# Altium project Inverter_control_r2.PrjPcb
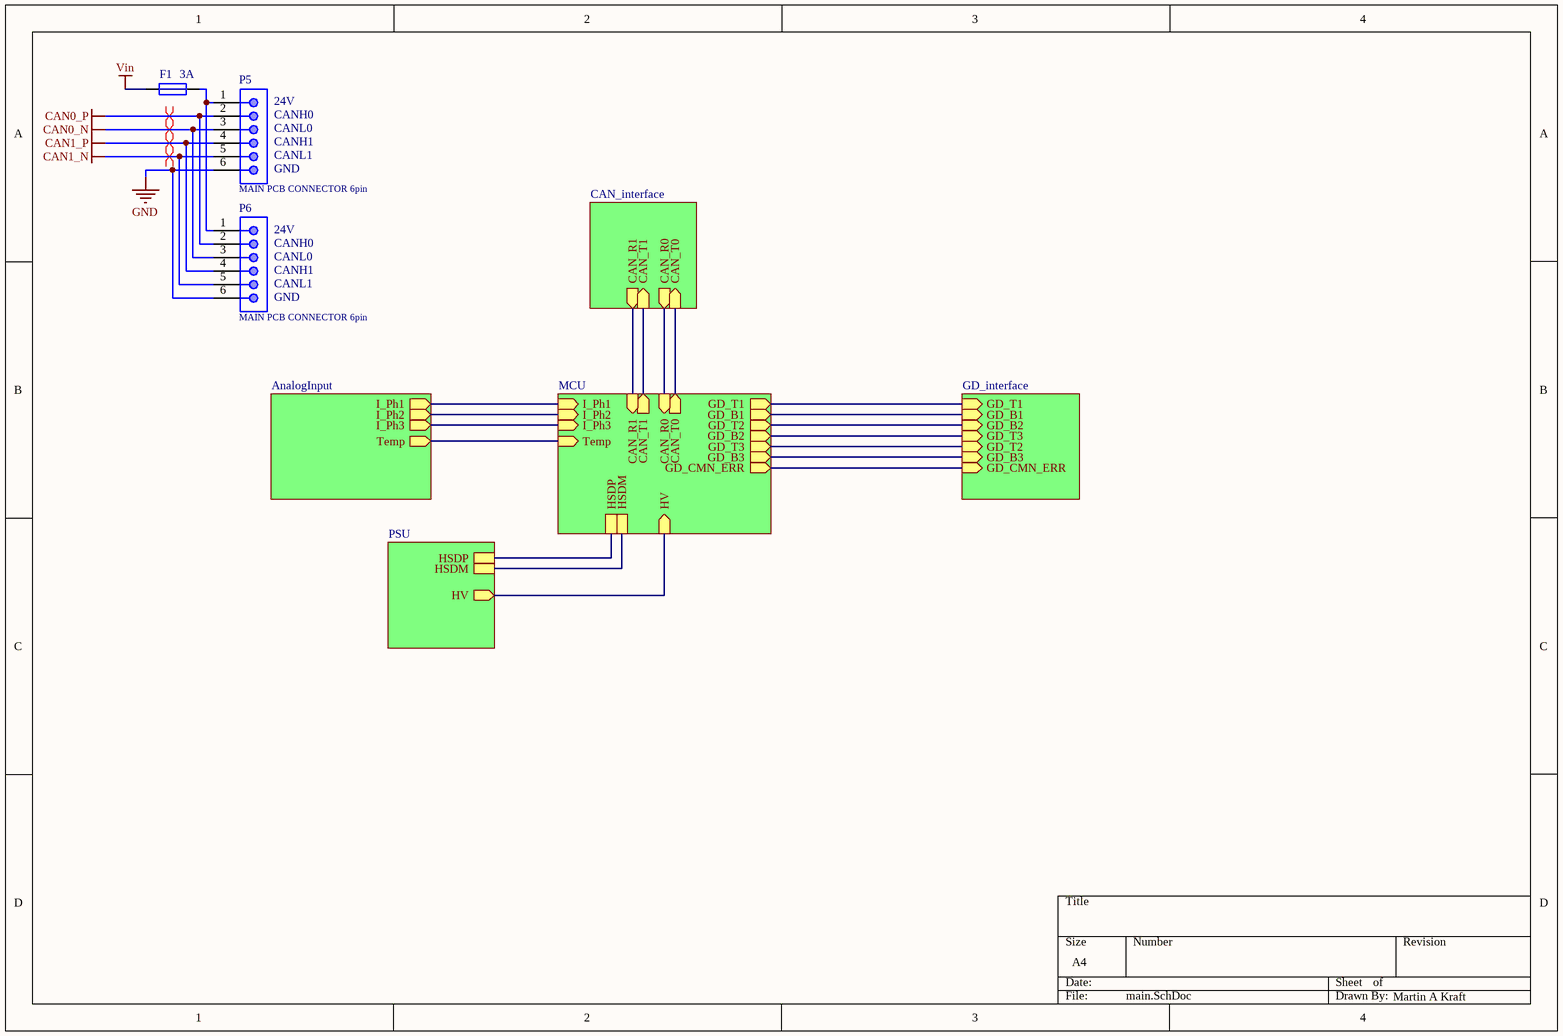
[diagram p0: main.SchDoc]
10 sheets, 146 parts. Net scope: hierarchical (ports join the sheet entries above them; power ports are global).
Board file: Inverter_control_r2.PcbDoc
Sheets:
  main.SchDoc
    MCU = MCU.SchDoc
    GD_interface = GD_interface.SchDoc
    CAN_interface = CAN_interface.SchDoc
      CAN0 = CAN0.SchDoc
      CAN1 = CAN1.SchDoc
    PSU = PSU.SchDoc
      3V3 = 3V3.SchDoc
      5V = 5V.SchDoc
      GD_supply = GD_supply.SchDoc

## Sheet main.SchDoc
size A4

### Parts
F1  3A  [F_OMH125]
P5  MAIN PCB CONNECTOR 6pin  [662106145021]
P6  MAIN PCB CONNECTOR 6pin  [662106145021]

### Sub-sheets
AnalogInput = InverterControl_AnalogIn.SchDoc (file not in this document): I_Ph1 (out), I_Ph2 (out), I_Ph3 (out), Temp (out)
CAN_interface = CAN_interface.SchDoc: CAN_R0 (out), CAN_T0 (in), CAN_R1 (out), CAN_T1 (in)
GD_interface = GD_interface.SchDoc: GD_T1 (in), GD_B1 (in), GD_T2 (in), GD_B2 (in), GD_T3 (in), GD_B3 (in), GD_CMN_ERR (in)
MCU = MCU.SchDoc: I_Ph1 (in), I_Ph2 (in), I_Ph3 (in), Temp (in), GD_T1 (out), GD_B1 (out), GD_T2 (out), GD_B2 (out), GD_T3 (out), GD_B3 (out), CAN_T0 (out), CAN_R0 (in), CAN_T1 (out), CAN_R1 (in), HSDM, HSDP, HV (in), GD_CMN_ERR (out)
PSU = PSU.SchDoc: HSDM, HSDP, HV (out)

### Nets
CAN0_N: P5.3 P6.3
CAN0_P: P5.2 P6.2
CAN1_N: P5.5 P6.5
CAN1_P: P5.4 P6.4
GND: P5.6 P6.6
Vin: F1.1
CAN_R0: sheet MCU/CAN_R0, sheet CAN_interface/CAN_R0
CAN_R1: sheet MCU/CAN_R1, sheet CAN_interface/CAN_R1
CAN_T0: sheet MCU/CAN_T0, sheet CAN_interface/CAN_T0
CAN_T1: sheet MCU/CAN_T1, sheet CAN_interface/CAN_T1
NetC36_2: sheet MCU/HV, sheet PSU/HV
NetF1_2: F1.2 P5.1 P6.1
NetIC2_3: sheet MCU/GD_B3, sheet GD_interface/GD_B3
NetIC2_5: sheet MCU/GD_B2, sheet GD_interface/GD_T3
NetIC2_7: sheet MCU/GD_T2, sheet GD_interface/GD_B2
NetIC2_9: sheet MCU/GD_T3, sheet GD_interface/GD_T2
NetIC2_11: sheet MCU/GD_B1, sheet GD_interface/GD_B1
NetIC2_14: sheet MCU/GD_T1, sheet GD_interface/GD_T1
NetIC3_13: sheet AnalogInput/I_Ph1, sheet MCU/I_Ph1
NetIC3_14: sheet AnalogInput/I_Ph2, sheet MCU/I_Ph2
NetIC3_15: sheet AnalogInput/I_Ph3, sheet MCU/I_Ph3
NetIC3_16: sheet AnalogInput/Temp, sheet MCU/Temp
NetIC3_52: sheet MCU/GD_CMN_ERR, sheet GD_interface/GD_CMN_ERR
NetIC3_94: sheet MCU/HSDM, sheet PSU/HSDM
NetIC3_95: sheet MCU/HSDP, sheet PSU/HSDP

### Layout directives
differential pair: CAN0_N, CAN0_P, CAN1_N, CAN1_P

### Notes on the sheet
- Martin A Kraft
- (in symbol MAIN PCB CONNECTOR 6pin) 24V; CANH0; CANL0; CANH1; CANL1; GND

### Library data of the parts
F1 = F_Fuse: Fuse - universal; ComponentLink1Description: Datasheet; ComponentLink1URL: https://ch.schurter.com/en/datasheet/typ_OMF_63.pdf
P5 P6 = MAIN PCB CONNECTOR 6pin: SMT Male Header WR-MPC3, with SMT Solder Tabs, Right Angled, Single Row, pitch 3 mm, 6 pins; Pitch: 3 mm; Working Voltage: 250 VAC; Contact Resistance: 10 mOhm; Pin Number: 6; ComponentLink1Description: Manufacturer; ComponentLink1URL: http://www.we-online.de; ComponentLink2Description: Datasheet; ComponentLink2URL: https://katalog.we-online.de/em/datasheet/6621xx145021.pdf; Part Number: 662106145021; Published Date: September 2018; Publisher: Wurth Elektronik; Operating Temperature: -40 to 105 degC; Packaging: Tape and Reel; Gender: Male; Mounting Technology: SMT; Orientation: Right Angled

## Sheet MCU.SchDoc
size A4
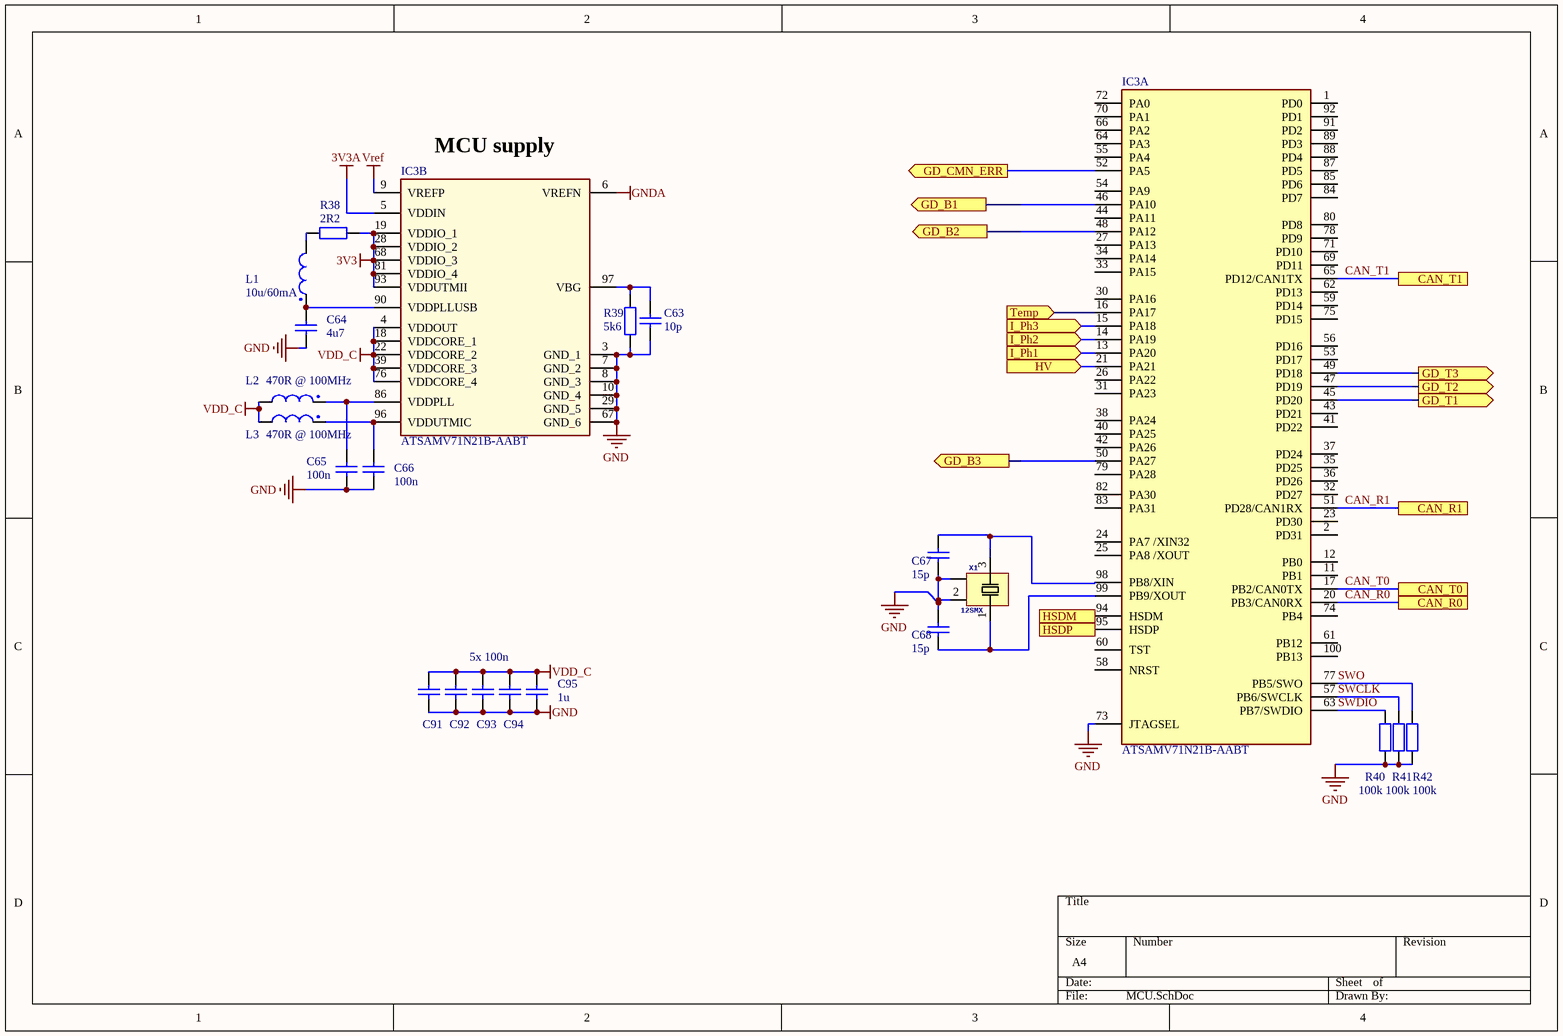
[diagram p1: MCU.SchDoc]

### Parts
C63  10p  [C_0603]
C64  4u7  [C_0805]
C65  100n  [C_0603]
C66  100n  [C_0603]
C67  15p  [C_0603]
C68  15p  [C_0603]
C91  100n  [C_0603]  (value not drawn)
C92  100n  [C_0603]  (value not drawn)
C93  100n  [C_0603]  (value not drawn)
C94  100n  [C_0603]  (value not drawn)
C95  1u  [C_0805]
IC3  ATSAMV71N21B-AABT  [QFP50P1600X1600X160-100N]  (parts A,B of 2)
L1  10u/60mA  [R_0805]
L2  470R @ 100MHz  [R_0805]
L3  470R @ 100MHz  [R_0805]
R38  2R2  [R_0603]
R39  5k6  [R_0603]
R40  100k  [R_0603]
R41  100k  [R_0603]
R42  100k  [R_0603]
X1  12SMX  [WE-XTAL_12SMX]

### Ports
CAN_R0, CAN_R1, CAN_T0, CAN_T1, GD_B1 (out), GD_B2 (out), GD_B3 (out), GD_CMN_ERR (out), GD_T1 (out), GD_T2 (out), GD_T3 (out), HSDM, HSDP, HV (in), I_Ph1 (in), I_Ph2 (in), I_Ph3 (in), Temp (in)

### Nets
3V3: IC3.5(VDDIN) IC3.19(VDDIO_1) IC3.28(VDDIO_2) IC3.68(VDDIO_3) IC3.81(VDDIO_4) IC3.93(VDDUTMII) R38.2  [also labelled 3V3A]
GND: C63.2 C64.1 C65.1 C66.1 C67.2 C68.1 C91.1 C92.1 C93.1 C94.1 C95.1 IC3.3(GND_1) IC3.6(VREFN) IC3.7(GND_2) IC3.8(GND_3) IC3.10(GND_4) IC3.29(GND_5) IC3.67(GND_6) IC3.73(JTAGSEL) R39.2 R40.2 R41.2 R42.2 X1.2 X1.4  [also labelled GNDA]
VDD_C: C91.2 C92.2 C93.2 C94.2 C95.2 IC3.4(VDDOUT) IC3.18(VDDCORE_1) IC3.22(VDDCORE_2) IC3.39(VDDCORE_3) IC3.76(VDDCORE_4) L2.2 L3.2
Vref: IC3.9(VREFP)
CAN_R0: IC3.20(PB3/CAN0RX) ; port CAN_R0
CAN_R1: IC3.51(PD28/CAN1RX) ; port CAN_R1
CAN_T0: IC3.17(PB2/CAN0TX) ; port CAN_T0
CAN_T1: IC3.65(PD12/CAN1TX) ; port CAN_T1
SWCLK: IC3.57(PB6/SWCLK) R41.1
SWDIO: IC3.63(PB7/SWDIO) R40.1
SWO: IC3.77(PB5/SWO) R42.1
NetC36_2: IC3.21(PA21) ; port HV
NetC63_1: C63.1 IC3.97(VBG) R39.1
NetC64_2: C64.2 IC3.90(VDDPLLUSB) L1.1
NetC65_2: C65.2 IC3.86(VDDPLL) L2.1
NetC66_2: C66.2 IC3.96(VDDUTMIC) L3.1
NetC67_1: C67.1 IC3.98(PB8/XIN) X1.3
NetC68_2: C68.2 IC3.99(PB9/XOUT) X1.1
NetIC2_3: IC3.50(PA27) ; port GD_B3
NetIC2_5: IC3.48(PA12) ; port GD_B2
NetIC2_7: IC3.47(PD19) ; port GD_T2
NetIC2_9: IC3.49(PD18) ; port GD_T3
NetIC2_11: IC3.46(PA10) ; port GD_B1
NetIC2_14: IC3.45(PD20) ; port GD_T1
NetIC3_13: IC3.13(PA20) ; port I_Ph1
NetIC3_14: IC3.14(PA19) ; port I_Ph2
NetIC3_15: IC3.15(PA18) ; port I_Ph3
NetIC3_16: IC3.16(PA17) ; port Temp
NetIC3_52: IC3.52(PA5) ; port GD_CMN_ERR
NetIC3_94: IC3.94(HSDM) ; port HSDM
NetIC3_95: IC3.95(HSDP) ; port HSDP
NetL1_2: L1.2 R38.1

Not connected (* = marked no-connect by the designer): IC3 1(PD0) 2(PD31) 11(PB1) 12(PB0) 23(PD30) 24(PA7_/XIN32) 25(PA8_/XOUT) 26(PA22) 27(PA13) 30(PA16) 31(PA23) 32(PD27) 33(PA15) 34(PA14) 35(PD25) 36(PD26) 37(PD24) 38(PA24) 40(PA25) 41(PD22) 42(PA26) 43(PD21) 44(PA11) 53(PD17) 54(PA9) 55(PA4) 56(PD16) 58(NRST) 59(PD14) 60(TST) 61(PB12) 62(PD13) 64(PA3) 66(PA2) 69(PD11) 70(PA1) 71(PD10) 72(PA0) 74(PB4) 75(PD15) 78(PD9) 79(PA28) 80(PD8) 82(PA30) 83(PA31) 84(PD7) 85(PD6) 87(PD5) 88(PD4) 89(PD3) 91(PD2) 92(PD1) 100(PB13)

### Notes on the sheet
- (near IC3) MCU supply
- 5x 100n

### Library data of the parts
C63-C68 C91-C95 = C_MLCC: cond
  C63: Value: 10p
  C64: Value: 4u7
  C65 C66 C91-C94: Value: 100n
  C67 C68: Value: 15p
  C95: Value: 1u
IC3 = ATSAMV71N21B-AABT: Integrated Circuit; Manufacturer_Name: Microchip; Datasheet Link: http://ww1.microchip.com/downloads/en/DeviceDoc/SAM-E70S70V70V71-Family%20DataSheet-DS60001527B.pdf; Height: 1.6mm; Manufacturer_Part_Number: ATSAMV71N21B-AABT; Mouser Part Number: 556-ATSAMV71N21BAABT; Mouser Price/Stock: https://www.mouser.com/Search/Refine.aspx?Keyword=556-ATSAMV71N21BAABT
L1-L3 = L_Inductor_Choke
R38-R42 = R_Uni: Resistor
  R38: Value: 2R2
  R39: Value: 5k6
  R40-R42: Value: 100k
X1 = WE-XTAL_12SMX: WE-XTAL Quartz Crystal   Characteristics   Industry standard packages       Details see: https://katalog.we-online.com/en/pbs/WE-XTAL  Updated by Ella Wu , 2019-09-03  2019 (C) Wurth Elektronik; PART-NUMBER: 830026380; PART-NUMBER: 830026382; PART-NUMBER: 830026384; PART-NUMBER: 830026386; PART-NUMBER: 830026388; PART-NUMBER: 830026392; PART-NUMBER: 830026394; PART-NUMBER: 830026396; PART-NUMBER: 830026504; PART-NUMBER: 830059082; GateName_1: G$1; SymbolName_1: CRYSTAL-4PIN; C-LOAD: 16pF; STABILITY: 50ppm; TOLERANCE: ±30ppm; C-LOAD: 10pF; TOLERANCE: ±20ppm; LibraryName: Eagle_WE-XTAL (rev19a); DeviceSetName: WE-XTAL_12SMX; Package: WE-XTAL_12SMX; DATASHEET-URL: https://katalog.we-online.com/pbs/datasheet/830026380.pdf; MOUNT: SMT; DATASHEET-URL: https://katalog.we-online.com/pbs/datasheet/830026382.pdf; DATASHEET-URL: https://katalog.we-online.com/pbs/datasheet/830026384.pdf; DATASHEET-URL: https://katalog.we-online.com/pbs/datasheet/830026386.pdf; DATASHEET-URL: https://katalog.we-online.com/pbs/datasheet/830026388.pdf; DATASHEET-URL: https://katalog.we-online.com/pbs/datasheet/830026392.pdf; DATASHEET-URL: https://katalog.we-online.com/pbs/datasheet/830026394.pdf; DATASHEET-URL: https://katalog.we-online.com/pbs/datasheet/830026396.pdf; DATASHEET-URL: https://katalog.we-online.com/pbs/datasheet/830026504.pdf; DATASHEET-URL: https://katalog.we-online.com/pbs/datasheet/830059082.pdf

## Sheet GD_interface.SchDoc
size A4
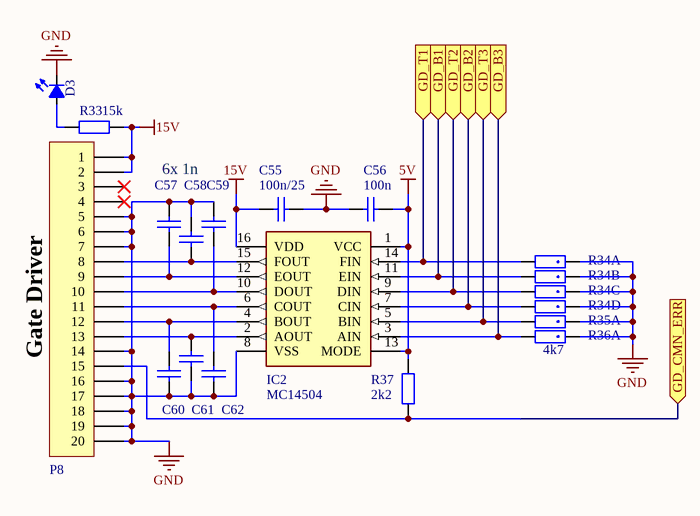
[diagram p2: GD_interface.SchDoc]

### Parts
C55  100n/25  [C_0603]
C56  100n  [C_0603]
C57  1n  [C_0603]  (value not drawn)
C58  1n  [C_0603]  (value not drawn)
C59  1n  [C_0603]  (value not drawn)
C60  1n  [C_0603]  (value not drawn)
C61  1n  [C_0603]  (value not drawn)
C62  1n  [C_0603]  (value not drawn)
D3  Green  [D0603]  (value not drawn)
IC2  MC14504  [SOP65P640X120-16N]
P8  GD  [TE_MicroMatch_20_SMD_Female]  (value not drawn)
R33  15k  [R_0603]
R34  1k  [R_Array  4D03]  (value not drawn)  (parts A,B,C,D of 4)
R35  1k  [R_Array  4D03]  (value not drawn)  (part A of 4)
R36  4k7  [R_Array  4D03]  (part A of 4)
R37  2k2  [R_0603]

### Ports
GD_B1 (in), GD_B2 (in), GD_B3 (in), GD_CMN_ERR (in), GD_T1 (in), GD_T2 (in), GD_T3 (in)

### Nets
5V: C56.2 IC2.1(VCC) IC2.13(MODE) R37.1
15V: C55.1 IC2.16(VDD) P8.1 P8.2 R33.2
GND: C55.2 C56.1 C57.2 C58.2 C59.2 C60.1 C61.1 C62.1 D3.1(K) IC2.8(VSS) P8.5 P8.6 P8.7 P8.14 P8.16 P8.17 P8.18 P8.19 P8.20 R34.1 R34.2 R34.3 R34.4 R35.1 R36.1
NetC57_1: C57.1 IC2.12(EOUT) P8.9
NetC58_1: C58.1 IC2.15(FOUT) P8.8
NetC59_1: C59.1 IC2.10(DOUT) P8.10
NetC60_2: C60.2 IC2.4(BOUT) P8.12
NetC61_2: C61.2 IC2.6(COUT) P8.11
NetC62_2: C62.2 IC2.2(AOUT) P8.13
NetD3_2: D3.2(A) R33.1
NetIC2_3: IC2.3(AIN) R36.8 ; port GD_B3
NetIC2_5: IC2.5(BIN) R35.8 ; port GD_T3
NetIC2_7: IC2.7(CIN) R34.5 ; port GD_B2
NetIC2_9: IC2.9(DIN) R34.6 ; port GD_T2
NetIC2_11: IC2.11(EIN) R34.7 ; port GD_B1
NetIC2_14: IC2.14(FIN) R34.8 ; port GD_T1
NetIC3_52: P8.15 R37.2 ; port GD_CMN_ERR

Not connected (* = marked no-connect by the designer): P8 3* 4*

### Notes on the sheet
- 6x 1n
- (near P8) Gate Driver

### Library data of the parts
C55-C62 = C_MLCC: cond
  C55: Value: 100n/25
  C56: Value: 100n
  C57-C62: Value: 1n
D3 = D_LED small: LED diode
IC2 = IC_MC14504: Level shifter; Manufacturer_Name: ON Semiconductor; Manufacturer_Part_Number: MC14504BDTG; Allied_Number: 70466282; Datasheet Link: http://www.onsemi.com/pub/Collateral/MC14504B-D.PDF; Height: 1.2mm; Mouser Part Number: 863-MC14504BDTG; Mouser Price/Stock: https://www.mouser.com/Search/Refine.aspx?Keyword=863-MC14504BDTG; RS Part Number: 8063258; RS Price/Stock: https://uk.rs-online.com/web/p/products/8063258; Allied Price/Stock: http://www.alliedelec.com/on-semiconductor-mc14504bdtg/70466282/; ComponentLink1Description: Datasheet; ComponentLink1URL: https://www.mouser.sk/datasheet/2/308/MC14504B-D-103983.pdf
P8 = Header 20: Te connectivity Micro Match: 2-338069-0; Manufacturer: Tyco; Order number: 2-338069-0 or 9-338069-0; ComponentLink1Description: TE website; ComponentLink1URL: https://www.te.com/usa-en/product-2-338069-0.html
R33 R37 = R_Uni: Resistor
  R33: Value: 15k
  R37: Value: 2k2
R34-R36 = R_Array 4xR: Resistor array 4xR,  size 1206, 64mW; Name_: Michal Minarik; Wattage: 1/16W; Working voltage: 50V; DATE_: 10.5.2018

## Sheet CAN_interface.SchDoc
size A4
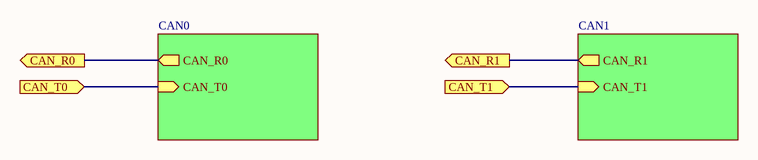
[diagram p3: CAN_interface.SchDoc]

### Sub-sheets
CAN0 = CAN0.SchDoc: CAN_R0 (out), CAN_T0 (in)
CAN1 = CAN1.SchDoc: CAN_R1 (out), CAN_T1 (in)

### Ports
CAN_R0 (out), CAN_R1 (out), CAN_T0 (in), CAN_T1 (in)

### Nets
CAN_R0: port CAN_R0, sheet CAN0/CAN_R0
CAN_R1: port CAN_R1, sheet CAN1/CAN_R1
CAN_T0: port CAN_T0, sheet CAN0/CAN_T0
CAN_T1: port CAN_T1, sheet CAN1/CAN_T1

## Sheet CAN0.SchDoc
size A4
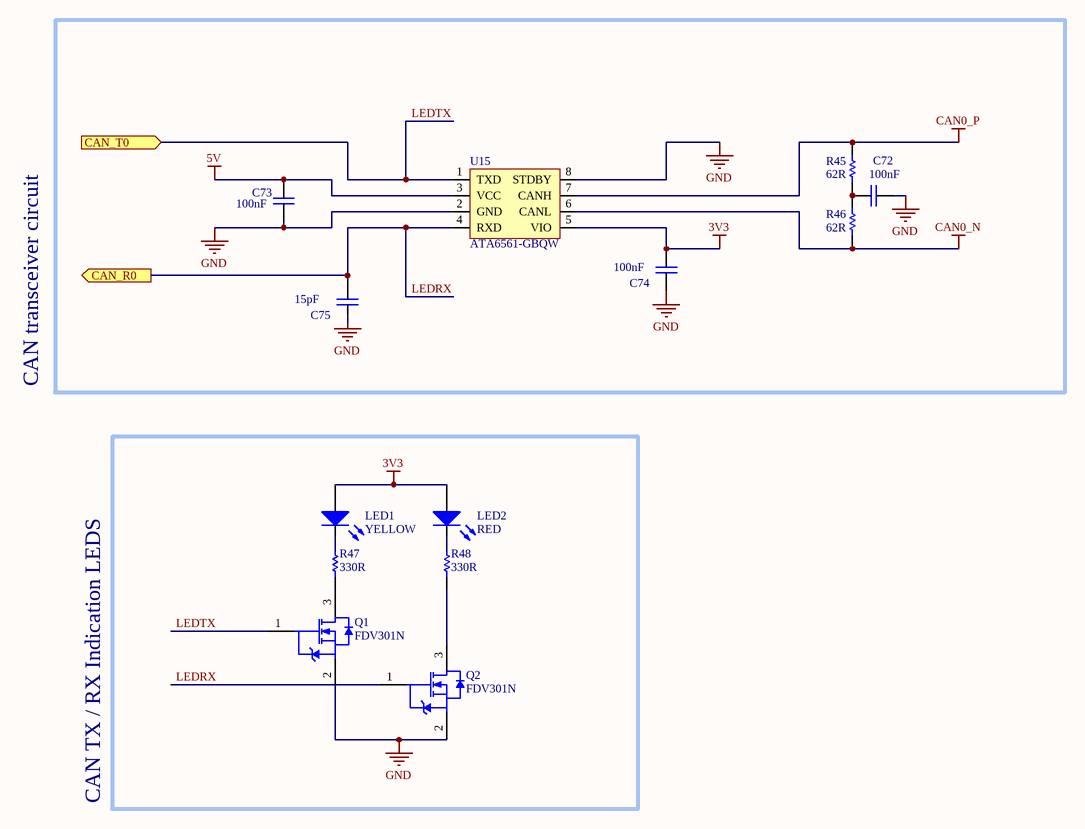
[diagram p4: CAN0.SchDoc]

### Parts
C72  value 100nF  [C1206]  (hidden comment: C1206C106K3PACTU)
C73  value 100nF  [C1206]  (hidden comment: C1206C106K3PACTU)
C74  value 100nF  [C1206]  (hidden comment: C1206C106K3PACTU)
C75  value 15pF  [C1206]  (hidden comment: C1206C106K3PACTU)
LED1  YELLOW  [0603_A]
LED2  RED  [0603_A]
Q1  FDV301N  [FAIR-SOT23-3_V]
Q2  FDV301N  [FAIR-SOT23-3_V]
R45  62R  [RESC0603(1608)_L]
R46  62R  [RESC0603(1608)_L]
R47  330R  [RESC0603(1608)_L]
R48  330R  [RESC0603(1608)_L]
U15  ATA6561-GBQW  [LME49721MA/NOPB]

### Ports
CAN_R0 (out), CAN_T0 (in)

### Nets
3V3: C74.2 LED1.2(A) LED2.2(A) U15.5(VIO)
5V: C73.2 U15.3(VCC)
CAN0_N: R46.2 U15.6(CANL)
CAN0_P: R45.1 U15.7(CANH)
GND: C72.1 C73.1 C74.1 C75.1 Q1.2(S) Q2.2(S) U15.2(GND) U15.8(STDBY)
LEDRX: C75.2 Q2.1(G) U15.4(RXD) ; port CAN_R0  [project net CAN_R0]
LEDTX: Q1.1(G) U15.1(TXD) ; port CAN_T0  [project net CAN_T0]
NetC72_2: C72.2 R45.2 R46.1
NetLED1_1: LED1.1(K) R47.1
NetLED2_1: LED2.1(K) R48.1
NetQ1_3: Q1.3(D) R47.2
NetQ2_3: Q2.3(D) R48.2

### Notes on the sheet
- CAN transceiver circuit
- CAN TX / RX Indication LEDS

### Library data of the parts
C72-C75 = C1206C106K3PACTU: C1206
LED1 LED2 = CMP-1426-00001-1: SMD mono-color Chip LED, WL-SMCW, Red; Manufacturer: Wuerth Elektronik; PartNumber: 150060RS75000; Color: Red; PackageReference: 0603_A; ComponentLink2URL: http://katalog.we-online.com/led/datasheet/150060RS75000.pdf; ComponentLink1URL: http://www.we-online.com; ComponentLink1Description: Manufacturer URL; ComponentLink2Description: Datasheet
Q1 Q2 = CMP-2000-04935-1: Digital FET, N-Channel, 0.35 W, 25 V, -55 to 150 degC, 3-Pin SOT23, RoHS, Tape and Reel; Manufacturer: Fairchild; Rds(on) Test Voltage Vgs: 2.7V; Threshold Voltage Vgs Typ: 850mV; Voltage Vds Typ: 25V; Transistor Case Style: SOT-23; Reel Quantity: 3000; Voltage Vgs Rds on Measurement: 4.5V; Power Dissipation Pd: 350mW; Continuous Drain Current Id: 220mA; Transistor Polarity: NChannel; No. of Transistors: 1; Package Version: Rev. 12, 03/2016; Voltage Vgs th Max: 1.5V; ESD HBM: 6kV; Pulse Current Idm: 500mA; Current Temperature: 25degC; On Resistance Rds(on): 5ohm; External Depth: 2.5mm; SMD Marking: 301; No. of Pins: 3; External Width: 3.05mm; SVHC: NoSVHC(19-Dec-2012); External Length / Height: 1.12mm; Termination Type: SMD; Package Reference: SOT23-3; Package URL: http://www.fairchildsemi.com/dwg/MA/MA03D.pdf; Voltage Vgs Max: 850mV; Drain Source Voltage Vds: 25V; Operating Temperature Max: 150degC; Package Description: 3-Pin Small Outline Transistor, Body 2.92 x 1.325 mm, Pitch 0.95 mm; Operating Temperature Min: -55degC; Datasheet Version: Jun-09; Tape Width: 8mm; Full Power Rating Temperature: 25degC; Datasheet URL: https://datasheet.ciiva.com/8114/fdv301n-8114688.pdf; Package / Case: SOT-23; Manufacturer URL: https://www.fairchildsemi.com/; Current Id Max: 220mA; Operating Temperature Range: -55degCto+150degC
R45-R48 = CMP-1012-00062-1: 330R 0.1W 5% 0603 (1608 Metric)  SMD; Value: 330.00 Ohm; Case-EIA: 0603; Case-Metric: 1608; Tolerance: 5 %; Power: 0.1 W; Technology: SMT

## Sheet CAN1.SchDoc
size A4
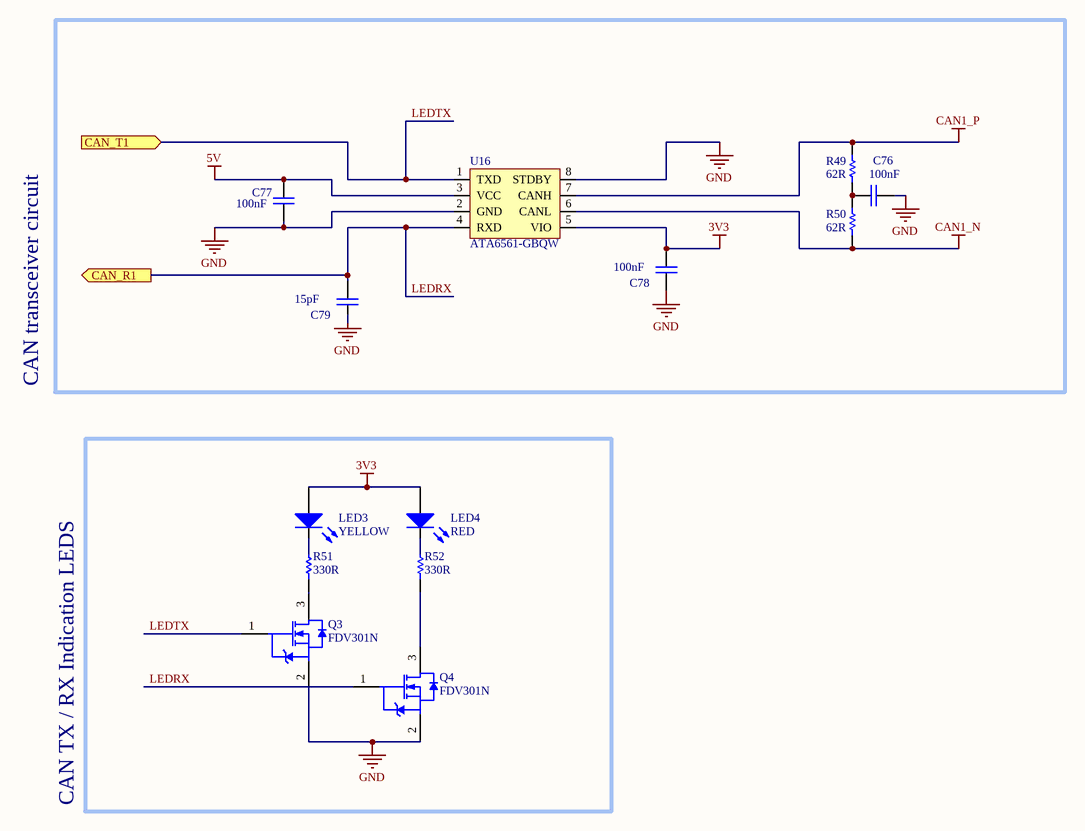
[diagram p5: CAN1.SchDoc]

### Parts
C76  value 100nF  [C1206]  (hidden comment: C1206C106K3PACTU)
C77  value 100nF  [C1206]  (hidden comment: C1206C106K3PACTU)
C78  value 100nF  [C1206]  (hidden comment: C1206C106K3PACTU)
C79  value 15pF  [C1206]  (hidden comment: C1206C106K3PACTU)
LED3  YELLOW  [0603_A]
LED4  RED  [0603_A]
Q3  FDV301N  [FAIR-SOT23-3_V]
Q4  FDV301N  [FAIR-SOT23-3_V]
R49  62R  [RESC0603(1608)_L]
R50  62R  [RESC0603(1608)_L]
R51  330R  [RESC0603(1608)_L]
R52  330R  [RESC0603(1608)_L]
U16  ATA6561-GBQW  [LME49721MA/NOPB]

### Ports
CAN_R1 (out), CAN_T1 (in)

### Nets
3V3: C78.2 LED3.2(A) LED4.2(A) U16.5(VIO)
5V: C77.2 U16.3(VCC)
CAN1_N: R50.2 U16.6(CANL)
CAN1_P: R49.1 U16.7(CANH)
GND: C76.1 C77.1 C78.1 C79.1 Q3.2(S) Q4.2(S) U16.2(GND) U16.8(STDBY)
LEDRX: C79.2 Q4.1(G) U16.4(RXD) ; port CAN_R1  [project net CAN_R1]
LEDTX: Q3.1(G) U16.1(TXD) ; port CAN_T1  [project net CAN_T1]
NetC76_2: C76.2 R49.2 R50.1
NetLED3_1: LED3.1(K) R51.1
NetLED4_1: LED4.1(K) R52.1
NetQ3_3: Q3.3(D) R51.2
NetQ4_3: Q4.3(D) R52.2

### Notes on the sheet
- CAN transceiver circuit
- CAN TX / RX Indication LEDS

### Library data of the parts
C76-C79 = C1206C106K3PACTU: C1206
LED3 LED4 = CMP-1426-00001-1: as LED1 on sheet CAN0; Color: Red; PackageReference: 0603_A; ComponentLink2URL: http://katalog.we-online.com/led/datasheet/150060RS75000.pdf; ComponentLink1URL: http://www.we-online.com; ComponentLink1Description: Manufacturer URL; ComponentLink2Description: Datasheet
Q3 Q4 = CMP-2000-04935-1: as Q1 on sheet CAN0; Termination Type: SMD; Package Reference: SOT23-3; Package URL: http://www.fairchildsemi.com/dwg/MA/MA03D.pdf; Voltage Vgs Max: 850mV; Drain Source Voltage Vds: 25V; Operating Temperature Max: 150degC; Package Description: 3-Pin Small Outline Transistor, Body 2.92 x 1.325 mm, Pitch 0.95 mm; Operating Temperature Min: -55degC; Datasheet Version: Jun-09; Tape Width: 8mm; Full Power Rating Temperature: 25degC; Datasheet URL: https://datasheet.ciiva.com/8114/fdv301n-8114688.pdf; Package / Case: SOT-23; Manufacturer URL: https://www.fairchildsemi.com/; Current Id Max: 220mA; Operating Temperature Range: -55degCto+150degC
R49-R52 = CMP-1012-00062-1: as R45 on sheet CAN0; Tolerance: 5 %; Power: 0.1 W; Technology: SMT

## Sheet PSU.SchDoc
size A4
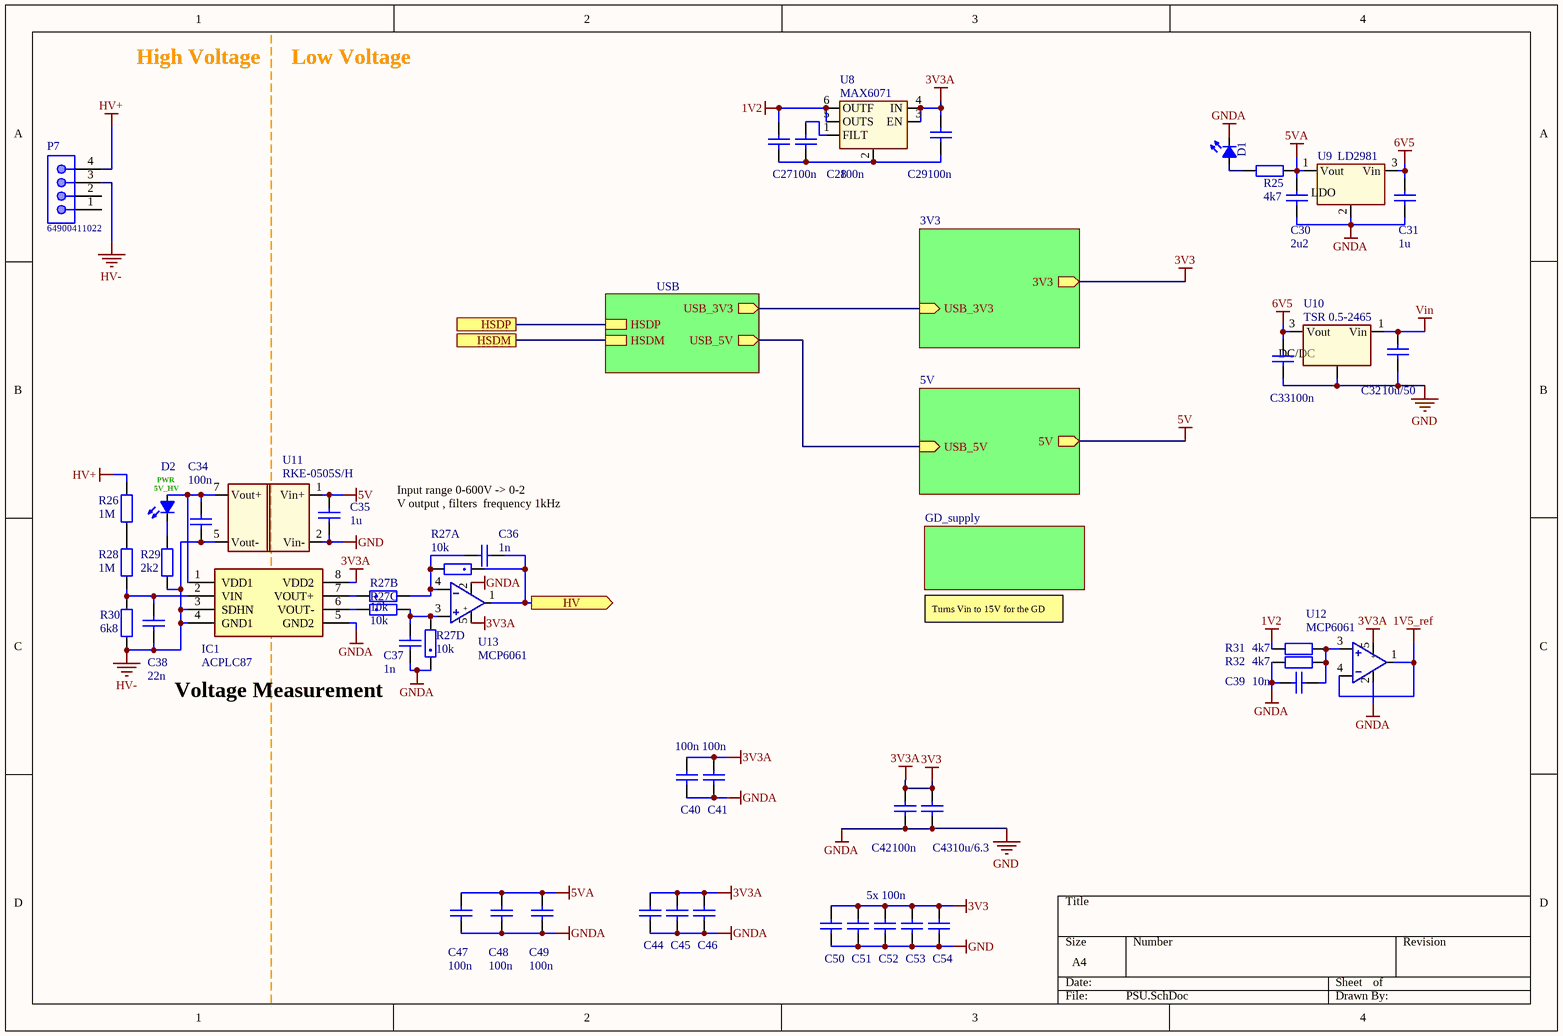
[diagram p6: PSU.SchDoc]

### Parts
C27  100n  [C_0603]
C28  100n  [C_0603]
C29  100n  [C_0603]
C30  2u2  [C_0805]
C31  1u  [C_0805]
C32  10u/50  [C_1210]
C33  100n  [C_0603]
C34  100n  [C_0603]
C35  1u  [C_0805]
C36  1n  [C_0603]
C37  1n  [C_0603]
C38  22n  [C_0603]
C39  10n  [C_0603]
C40  100n  [C_0603]
C41  100n  [C_0603]
C42  100n  [C_0603]
C43  10u/6.3  [C_1210]
C44  100n  [C_0603]  (value not drawn)
C45  100n  [C_0603]  (value not drawn)
C46  100n  [C_0603]  (value not drawn)
C47  100n  [C_0603]
C48  100n  [C_0603]
C49  100n  [C_0603]
C50  100n  [C_0603]  (value not drawn)
C51  100n  [C_0603]  (value not drawn)
C52  100n  [C_0603]  (value not drawn)
C53  100n  [C_0603]  (value not drawn)
C54  100n  [C_0603]  (value not drawn)
D1  Green  [D0603]  (value not drawn)
D2  Green  [D0603]  (value not drawn)
IC1  ACPLC87  [IC_ACPL87]
P7  64900411022  [64900411022]
R25  4k7  [R_0603]
R26  1M  [R_1206]
R27  10k  [R_Array  4D03]  (parts A,B,C,D of 4)
R28  1M  [R_1206]
R29  2k2  [R_0603]
R30  6k8  [R_0603]
R31  4k7  [R_0603]
R32  4k7  [R_0603]
U8  MAX6071  [sot23-6]
U9  LD2981  [SOT89]
U10  TSR 0.5-2465  [DCDC_Wurth_173950x36]
U11  RKE-0505S/H  [DCDC_RKExxxxSH]
U12  MCP6061  [SOT23-5]
U13  MCP6061  [SOT23-5]

### Sub-sheets
3V3 = 3V3.SchDoc: 3V3 (out), USB_3V3 (in)
5V = 5V.SchDoc: 5V (out), USB_5V (in)
GD_supply = GD_supply.SchDoc: no entries
USB = USB.SchDoc (file not in this document): USB_5V (out), USB_3V3 (out), HSDP, HSDM

### Ports
HSDM, HSDP, HV (out)

### Nets
1V2: C27.2 R31.1 U8.5(OUTS) U8.6(OUTF)
1V5_ref: U12.1(out_A) U12.4(IN-)
3V3: C29.2 C40.2 C41.2 C42.2 C43.1 C44.2 C45.2 C46.2 C50.2 C51.2 C52.2 C53.2 C54.2 IC1.8(VDD2) U8.3(EN) U8.4(IN) U12.5(vdd) U13.5(vdd) ; sheet 3V3/3V3, sheet 3V3/USB_3V3, sheet USB/USB_3V3  [also labelled 3V3A]
5V: C35.1 U11.1(Vin+) ; sheet 5V/5V, sheet 5V/USB_5V, sheet USB/USB_5V
5VA: C30.1 C47.1 C48.1 C49.1 R25.2 U9.1(Vout)
6V5: C31.2 C33.2 U9.3(Vin) U10.3(Vout)
GND: C30.2 C31.1 C32.2 C33.1 C35.2 C37.2 C39.2 C40.1 C41.1 C42.1 C43.2 C44.1 C45.1 C46.1 C47.2 C48.2 C49.2 C50.1 C51.1 C52.1 C53.1 C54.1 D1.1(K) IC1.5(GND2) R27.4 R32.2 U9.2(GND) U10.2(GND) U11.2(Vin-) U12.2(vss) U13.2(vss)  [also labelled GNDA]
HV+: P7.4 R26.1
HV-: C34.2 C38.2 IC1.3(SDHN) IC1.4(GND1) P7.3 R29.1 R30.2 U11.5(Vout-)
Vin: C32.1 U10.1(Vin)
NetC27_1: C27.1 C28.1 C29.1 U8.2(GND)
NetC28_2: C28.2 U8.1(FILT)
NetC34_1: C34.1 D2.2(A) IC1.1(VDD1) U11.7(Vout+)
NetC36_1: C36.1 R27.7 R27.8 U13.4(IN-)
NetC36_2: C36.2 R27.1 U13.1(out_A) ; port HV
NetC37_1: C37.1 R27.5 R27.6 U13.3(IN+)
NetC38_1: C38.1 IC1.2(VIN) R28.2 R30.1
NetC39_1: C39.1 R31.2 R32.1 U12.3(IN+)
NetD1_2: D1.2(A) R25.1
NetD2_1: D2.1(K) R29.2
NetIC1_6: IC1.6(VOUT-) R27.3
NetIC1_7: IC1.7(VOUT+) R27.2
NetIC3_94: port HSDM, sheet USB/HSDM
NetIC3_95: port HSDP, sheet USB/HSDP
NetR26_2: R26.2 R28.1

Not connected (* = marked no-connect by the designer): P7 1 2

### Notes on the sheet
- High Voltage
- Low Voltage
- PWR
  5V_HV
- Input range 0-600V -> 0-2
  V output , filters  frequency 1kHz
- Turns Vin to 15V for the GD
- Voltage Measurement
- 5x 100n
- (in symbol IC_ANA_MCP6061) +
- (in symbol IC_LDO_LD2981) LDO
- (in symbol PWR_TSR1-2450) DC/DC

### Library data of the parts
C27-C54 = C_MLCC: cond
  C27-C29 C33 C34 C40-C42 C50-C54: Value: 100n
  C30: Value: 2u2
  C31 C35: Value: 1u
  C32: Value: 10u/50
  C36 C37: Value: 1n
  C38: Value: 22n
  C39: Value: 10n
  C43: Value: 10u/6.3
  C44 C47: Value: 100n; ClassName: CH1
  C45 C48: Value: 100n; ClassName: CH2
  C46 C49: Value: 100n; ClassName: CH3
D1 D2 = D_LED small: LED diode
IC1 = IC_ANA_AmpISO_ACPLC87: isolation amplifier, 2V -1-GΩ  input; Manufacturer_Name: Avago Technologies; Manufacturer_Part_Number: ACPL-C87B-000E; Datasheet Link: https://componentsearchengine.com/Datasheets/2/ACPL-C87B-000E.pdf; Height: 3.307mm; Mouser Part Number: 630-ACPL-C87B-000E; Mouser Price/Stock: https://www.mouser.com/Search/Refine.aspx?Keyword=630-ACPL-C87B-000E; RS Part Number: 7687907P; RS Price/Stock: http://uk.rs-online.com/web/p/products/7687907P; ComponentLink1Description: Datasheet; ComponentLink1URL: https://docs.broadcom.com/docs/AV02-3563EN
P7 = 64900411022: THT Male Header WR-MPC4, with Mounting Flanges for Screw-in Retention, Right Angled, Single Row, pitch 4.2 mm, 4 pins; Pitch: 4.2 mm; Working Voltage: 600 VAC; Contact Resistance: 10 mOhm; Pin Number: 4; ComponentLink1Description: Manufacturer; ComponentLink1URL: http://www.we-online.de; ComponentLink2Description: Datasheet; ComponentLink2URL: https://katalog.we-online.de/em/datasheet/6490xx11022.pdf; Part Number: 64900411022; Published Date: November 2019; Publisher: Wurth Elektronik; Operating Temperature: -40 to 105 degC; Packaging: Tray; Gender: Male; Mounting Technology: THT; Orientation: Right Angled
R25 R26 R28-R32 = R_Uni: Resistor
  R25 R31 R32: Value: 4k7
  R26 R28: Value: 1M; ComponentLink1Description: Datasheet; ComponentLink1URL: https://www.mouser.sk/datasheet/2/54/CHV-777595.pdf
  R29: Value: 2k2
  R30: Value: 6k8
R27 = R_Array 4xR: as R34 on sheet GD_interface; DATE_: 10.5.2018
U8 = IC_LDO_REF_MAX6071: 3,00V ref
U9 = IC_LDO_LD2981: 5V sot 89; ComponentLink1Description: Datasheet; ComponentLink1URL: https://www.mouser.sk/datasheet/2/389/ld2981-974077.pdf
U10 = PWR_TSR1-2450: DC/DC Out: 5V 1A  In: 9-36V; ComponentLink1Description: Datasheet; ComponentLink1URL: https://www.mouser.sk/datasheet/2/687/tsr05-536572.pdf
U11 = PWR_RKE_H: Dc/Dc ISO 3kV Recom RKE Series 200mA; ComponentLink1Description: Datasheet; ComponentLink1URL: https://www.mouser.sk/datasheet/2/468/RKE-940986.pdf
U12 U13 = IC_ANA_MCP6061: Vcc:1.8 -6V, Vo:150uA. Iq:60uA; Manufacturer: Microchip; Manufacturer Part Number: MCP6061T-E/OT; No. of Comparators: 1 Comparator; Supply Voltage Range: 1.8V to 6V; No. of Pins: 5; Supplier 1: Mouser; Supplier Part Number 1: 579-MCP6061T-E/OT; ComponentLink1Description: Datasheet; ComponentLink1URL: http://ww1.microchip.com/downloads/en/DeviceDoc/MCP6061_DS22189B.pdf

## Sheet 3V3.SchDoc
size A4
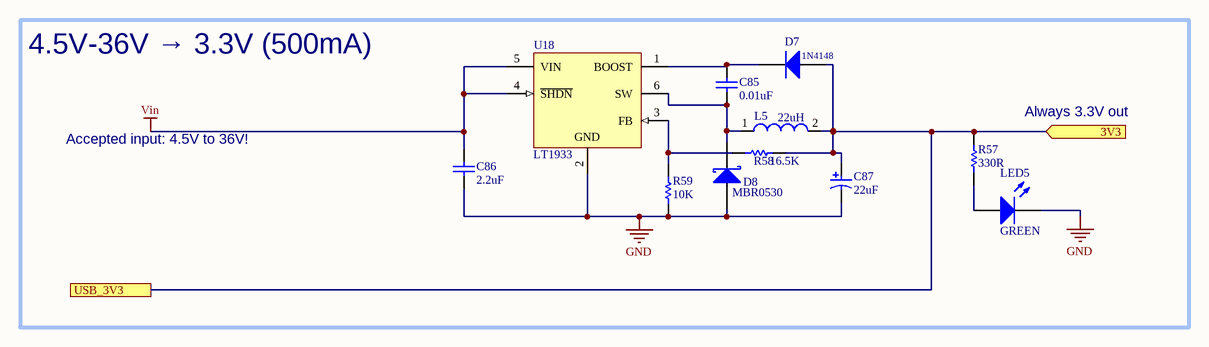
[diagram p7: 3V3.SchDoc]

### Parts
C85  0.01uF  [CAPC1608X87X35NL15T15]
C86  2.2uF  [CAPC2013X135X45ML10T25]
C87  22uF  [PNSC-EEE-FK1H220P_L]
D7  1N4148  [DIOD-SOD123-2_V]
D8  MBR0530  [FAIR-SOD123-2_V]
L5  22uH  [WE-PD-XL]
LED5  GREEN  [0603_A]
R57  330R  [RESC0603(1608)_L]
R58  16.5K  [RESC0603(1608)_L]
R59  10K  [RESC0603(1608)_L]
U18  LT1933  [LT-S6-6-SOT-23_L]

### Ports
3V3 (in), USB_3V3

### Nets
3V3: C87.1 D7.1(A) L5.2 R57.2 R58.1 ; port 3V3, port USB_3V3
GND: C86.1 C87.2 D8.1(A) LED5.1(K) R59.1 U18.2(GND)
Vin: C86.2 U18.4(~{SHDN}) U18.5(VIN)
NetC85_1: C85.1 D8.2(K) L5.1 U18.6(SW)
NetC85_2: C85.2 D7.2(K) U18.1(BOOST)
NetLED5_2: LED5.2(A) R57.1
NetR58_2: R58.2 R59.2 U18.3(FB)

### Notes on the sheet
- 4.5V-36V → 3.3V (500mA)
- Accepted input: 4.5V to 36V!
- Always 3.3V out

### Library data of the parts
C85 = CMP-2006-03308-1: 0.01uF 0603 50V; Manufacturer: Kemet; Part Number: C0603C101J5GACTU
C86 = CMP-2007-03522-1: Part Number: GRM21BF51E225ZA01L; Manufacturer: Murata
C87 = CMP-2000-06209-1: Cap Aluminum Lytic, 22 uF, +/- 20%, 6.3 to 100 V, -55 to 105 degC, 2-Pin SMD, RoHS, Tape and Reel; Manufacturer: Panasonic; Capacitance: 22µF; Rated Voltage: 50V; Lifetime@Temperature: 2000Hrs@105°C; Ripple Current: 165mA; Impedance: 0.88O; Type: Can; Operating Temp Range: -55to+105°C; Package Reference: EEE-FK1H220P; Case Size/Dimension: Ø6.3x5.8mm; Manufacturer URL: http://www.panasonic.com/; Datasheet URL: http://www.mouser.com/ds/2/315/ABA0000CE120-68386.pdf; Mounting Technology: SurfaceMount; Datasheet Version: 03/2014; Package Description: 2-Pin Aluminum Electrolytic Capacitor, Base 6.6 x 6.6 mm, Height 6.10 mm; Operating Temp-Max: 105°C; Series: FK
D7 = CMP-2000-04932-2: Fast Switching Diode, 100 V, 0.15 A, -65 to 150 degC, 2-Pin?SOD123, RoHS, Tape and Reel; Recovery Time: 4ns; Brand: DiodesIncorporated; Unit Weight: 0.000353oz; Max Surge Current: 2A; Peak Reverse Voltage: 100V; Ir - Reverse Current: 1uA; Vf - Forward Voltage: 1.25V; Configuration: Single; If - Forward Current: 0.15A; Product Category: Diodes-GeneralPurpose,Power,Switching; Operating Temperature Range: -65Cto+150C; Packaging: Reel; Manufacturer URL: http://www.diodes.com/; Maximum Operating Temperature: +150C; Height: 1.25mm; Minimum Operating Temperature: -65C; Product: SwitchingDiodes; Package URL: http://www.diodes.com/datasheets/ds18004.pdf; Type: SwitchingDiode; Package Reference: SOD123-2; Width: 1.7mm; Datasheet URL: http://www.farnell.com/datasheets/1915529.pdf; Datasheet Version: Rev. 24-2, 10/2013; Series: 1N4148; Factory Pack Quantity: 3000; Length: 2.85mm; RoHS: True; Manufacturer: DiodesIncorporated; Mounting Style: SMD/SMT; Package / Case: SOD-123
D8 = CMP-2000-05113-1: Diode Schottky 30V 0.5A 2-Pin SOD-123 T/R; Manufacturer: Fairchild; Speed: FastRecovery=200mA(Io); Voltage - Forward (Vf) (Max) @ If: 430mV@500mA; Online Catalog: SchottkyDiode; Current - Reverse Leakage @ Vr: 130µA@30V; Current - Average Rectified (Io): 500mA; Other Names: MBR0530CT; Reverse Recovery Time (trr): -; Category: DiscreteSemiconductorProducts; Package / Case: SOD-123; Capacitance @ Vr, F: -; Operating Temperature - Junction: -65degC~125degC; Standard Package: 1; Packaging: CutTape(CT); Family: Diodes,Rectifiers-Single; Diode Type: Schottky; Series: -; Datasheet Version: Rev. 1.1.0, 10/2014; Supplier Device Package: SOD-123; Mounting Type: SurfaceMount; Datasheet URL: https://www.fairchildsemi.com/datasheets/MB/MBR0530.pdf; Manufacturer URL: https://www.fairchildsemi.com/; Voltage - DC Reverse (Vr) (Max): 30V
L5 = CMP-0227-00204-1: SMD-Shielded Power Inductor WE-PD, L = 22.0 µH; Inductance: 22.0 ÂµH; PackageVersion: 2004; PackageDescription: SMD Inductor, 2-Leads, Body 12.0 x 12.0 mm; ComponentLink1URL: http://www.we-online.com; PackageReference: WE-PD-XL; ComponentLink1Description: Manufacturer Link; ComponentLink2Description: Datasheet; DatasheetVersion: ver 5, Oct-2004; ComponentLink2URL: http://www.we-online.de/katalog/media/pdf/744770122.pdf
LED5 = CMP-1426-00006-1: SMD mono-color Chip LED, WL-SMCW, Bright Green; PartNumber: 150060VS75000; Manufacturer: Wuerth Elektronik; ComponentLink2URL: http://katalog.we-online.com/led/datasheet/150060VS75000.pdf; ComponentLink1Description: Manufacturer URL; PackageReference: 0603_A; ComponentLink2Description: Datasheet; ComponentLink1URL: http://www.we-online.com; Color: Bright Green
R57 = CMP-1012-00062-1: as R45 on sheet CAN0; Tolerance: 5 %; Power: 0.1 W; Technology: SMT
R58 = CMP-1012-00062-1: 16.5K 0.1W 5% 0603 (1608 Metric)  SMD; Value: 16500Ohm; Case-EIA: 0603; Case-Metric: 1608; Tolerance: 5 %; Power: 0.1 W; Technology: SMT
R59 = CMP-1012-00062-1: 10K 0.1W 5% 0603 (1608 Metric)  SMD; Value: 10000 Ohm; Case-EIA: 0603; Case-Metric: 1608; Tolerance: 5 %; Power: 0.1 W; Technology: SMT
U18 = CMP-0491-01634-1: 600 mA, 500 kHz Step-Down Switching Regulator, 6-pin SOT23 (S6-6), -40 to 85 degC, Pb-Free, Tape and Reel; PartNumber: LT1933ES6#TRPBF; Manufacturer: Linear Technology; Number of Outputs: 1; Packing: Tape and Reel; ComponentLink3URL: http://cds.linear.com/docs/en/datasheet/175435f.pdf; ComponentLink1Description: Manufacturer URL; ComponentLink2Description: Datasheet; ComponentLink2URL: http://cds.linear.com/docs/en/datasheet/1933fe.pdf; Mounting Technology: Surface Mount; ComponentLink1URL: http://www.linear.com/; PackageVersion: Aug-07; PackageDescription: 6-Pin Plastic SOT-23, Body 1.625 x 2.9 mm, Pitch 0.95 mm; PackageReference: S6-6; DatasheetVersion: Rev. E; RoHS: TRUE; ComponentLink3Description: Package Specification

## Sheet 5V.SchDoc
size A4
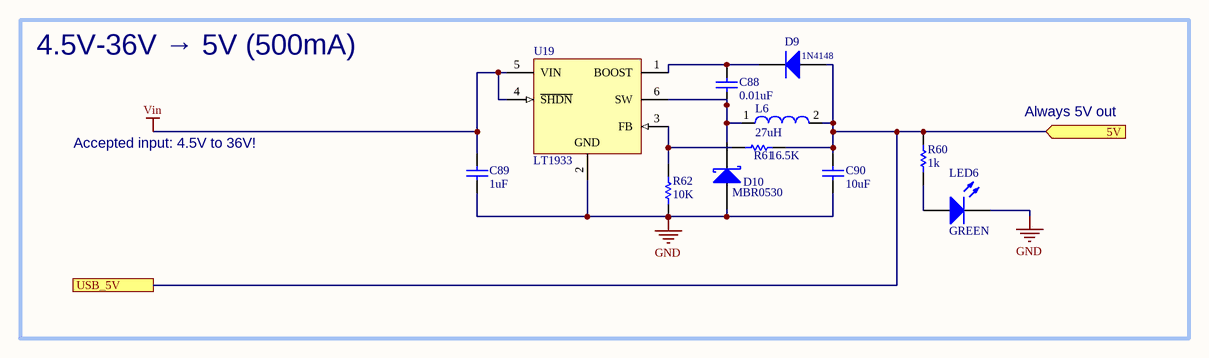
[diagram p8: 5V.SchDoc]

### Parts
C88  0.01uF  [CAPC1608X87X35NL15T15]
C89  1uF  [CAPC1608X87X35NL15T15]
C90  10uF  [CAPC1608X90X35NL10T15]
D9  1N4148  [DIOD-SOD123-2_V]
D10  MBR0530  [FAIR-SOD123-2_V]
L6  27uH  [WE-PD-M-PB]
LED6  GREEN  [0603_A]
R60  1k  [RESC0603(1608)_L]
R61  16.5K  [RESC0603(1608)_L]
R62  10K  [RESC0603(1608)_L]
U19  LT1933  [LT-S6-6-SOT-23_L]

### Ports
5V (in), USB_5V

### Nets
5V: C90.2 D9.1(A) L6.2 R60.2 R61.1 ; port 5V, port USB_5V
GND: C89.1 C90.1 D10.1(A) LED6.1(K) R62.1 U19.2(GND)
Vin: C89.2 U19.4(~{SHDN}) U19.5(VIN)
NetC88_1: C88.1 D10.2(K) L6.1 U19.6(SW)
NetC88_2: C88.2 D9.2(K) U19.1(BOOST)
NetLED6_2: LED6.2(A) R60.1
NetR61_2: R61.2 R62.2 U19.3(FB)

### Notes on the sheet
- 4.5V-36V → 5V (500mA)
- Accepted input: 4.5V to 36V!
- Always 5V out

### Library data of the parts
C88 = CMP-2006-03308-1: as C85 on sheet 3V3
C89 = CMP-2006-03308-1: 1uF 0603 50V; Manufacturer: Kemet; Part Number: C0603C101J5GACTU
C90 = CMP-2006-02792-1: Part Number: GRM188R60J106ME47D; Manufacturer: Murata
D9 = CMP-2000-04932-2: as D7 on sheet 3V3; Product Category: Diodes-GeneralPurpose,Power,Switching; Operating Temperature Range: -65Cto+150C; Packaging: Reel; Manufacturer URL: http://www.diodes.com/; Maximum Operating Temperature: +150C; Height: 1.25mm; Minimum Operating Temperature: -65C; Product: SwitchingDiodes; Package URL: http://www.diodes.com/datasheets/ds18004.pdf; Type: SwitchingDiode; Package Reference: SOD123-2; Width: 1.7mm; Datasheet URL: http://www.farnell.com/datasheets/1915529.pdf; Datasheet Version: Rev. 24-2, 10/2013; Series: 1N4148; Factory Pack Quantity: 3000; Length: 2.85mm; RoHS: True; Manufacturer: DiodesIncorporated; Mounting Style: SMD/SMT; Package / Case: SOD-123
D10 = CMP-2000-05113-1: as D8 on sheet 3V3; Reverse Recovery Time (trr): -; Category: DiscreteSemiconductorProducts; Package / Case: SOD-123; Capacitance @ Vr, F: -; Operating Temperature - Junction: -65degC~125degC; Standard Package: 1; Packaging: CutTape(CT); Family: Diodes,Rectifiers-Single; Diode Type: Schottky; Series: -; Datasheet Version: Rev. 1.1.0, 10/2014; Supplier Device Package: SOD-123; Mounting Type: SurfaceMount; Datasheet URL: https://www.fairchildsemi.com/datasheets/MB/MBR0530.pdf; Manufacturer URL: https://www.fairchildsemi.com/; Voltage - DC Reverse (Vr) (Max): 30V
L6 = CMP-1396-00053-1: SMD-Shielded Power Inductor WE-PD, L=27 µH; Manufacturer: Wuerth Elektronik; PartNumber: 7447779127; Inductance: 27 ÂµH; PackageDescription: SMD Inductor, 2-Leads, Body 7.3 x 7.3 mm; ComponentLink2Description: Datasheet; PackageReference: WE-PD-M-PB; ComponentLink1Description: Manufacturer URL; ComponentLink2URL: http://www.we-online.de/katalog/media/pdf/7447779127.pdf; ComponentLink1URL: http://www.we-online.com
LED6 = CMP-1426-00006-1: as LED5 on sheet 3V3; ComponentLink2URL: http://katalog.we-online.com/led/datasheet/150060VS75000.pdf; ComponentLink1Description: Manufacturer URL; PackageReference: 0603_A; ComponentLink2Description: Datasheet; ComponentLink1URL: http://www.we-online.com; Color: Bright Green
R60 = CMP-1012-00062-1: 1k 0.1W 5% 0603 (1608 Metric)  SMD; Value: 1000.00 Ohm; Case-EIA: 0603; Case-Metric: 1608; Tolerance: 5 %; Power: 0.1 W; Technology: SMT
R61 = CMP-1012-00062-1: as R58 on sheet 3V3; Tolerance: 5 %; Power: 0.1 W; Technology: SMT
R62 = CMP-1012-00062-1: as R59 on sheet 3V3; Tolerance: 5 %; Power: 0.1 W; Technology: SMT
U19 = CMP-0491-01634-1: as U18 on sheet 3V3; Packing: Tape and Reel; ComponentLink3URL: http://cds.linear.com/docs/en/datasheet/175435f.pdf; ComponentLink1Description: Manufacturer URL; ComponentLink2Description: Datasheet; ComponentLink2URL: http://cds.linear.com/docs/en/datasheet/1933fe.pdf; Mounting Technology: Surface Mount; ComponentLink1URL: http://www.linear.com/; PackageVersion: Aug-07; PackageDescription: 6-Pin Plastic SOT-23, Body 1.625 x 2.9 mm, Pitch 0.95 mm; PackageReference: S6-6; DatasheetVersion: Rev. E; RoHS: TRUE; ComponentLink3Description: Package Specification

## Sheet GD_supply.SchDoc
size A4
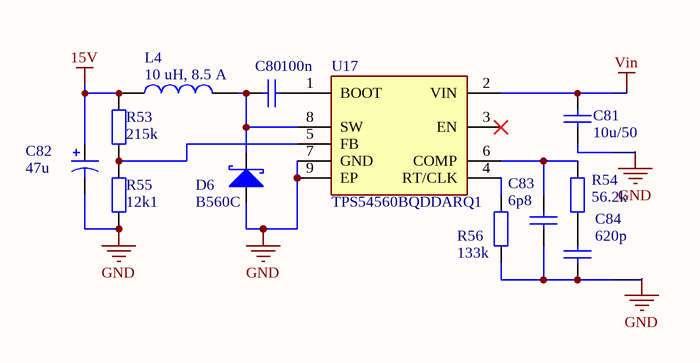
[diagram p9: GD_supply.SchDoc]

### Parts
C80  100n  [C_0603]
C81  10u/50  [C_1210]
C82  47u  [C_SMD_R8*10 Elyt]
C83  6p8  [C_0603]
C84  620p  [C_0603]
D6  B560C  [D_DO214AB-SMC]
L4  10 uH, 8.5 A  [WE-HCI_1350]
R53  215k  [R_0603]
R54  56.2k  [R_0603]
R55  12k1  [R_0603]
R56  133k  [R_0603]
U17  TPS54560BQDDARQ1  [IC_TPS54560BQDDARQ1]

### Nets
15V: C82.1 L4.2 R53.2
GND: C81.1 C82.2 C83.1 C84.1 D6.2(A) R55.1 R56.1 U17.7(GND) U17.9(EP)
Vin: C81.2 U17.2(VIN)
NetC80_1: C80.1 D6.1(K) L4.1 U17.8(SW)
NetC80_2: C80.2 U17.1(BOOT)
NetC83_2: C83.2 R54.2 U17.6(COMP)
NetC84_2: C84.2 R54.1
NetR53_1: R53.1 R55.2 U17.5(FB)
NetR56_2: R56.2 U17.4(RT/CLK)

Not connected (* = marked no-connect by the designer): U17 3(EN)*

### Library data of the parts
C80 C81 C83 C84 = C_MLCC: cond; ClassName: DcDc15
  C80: Value: 100n
  C81: Value: 10u/50
  C83: Value: 6p8
  C84: Value: 620p
C82 = C_Elyt: Polarized Capacitor; Value: 47u
D6 = D_Schottky: Schottky Diode; ClassName: DcDc15
L4 = 7443550101: SMT Flat Wire High Current Inductor WE-HCI, size 1350, 10 uH, 8.5 A; Rated Current: 8.5 A; Inductance: 10 uH; DC Resistance max.: 15.51 mOhm; Self Resonant Frequency: 18 MHz; Saturation Current: 10 A; Material: WE-PERM; Rated Inductance: 7.8 uH; ComponentLink1Description: Manufacturer; ComponentLink1URL: http://www.we-online.de; ComponentLink2Description: Datasheet; ComponentLink2URL: https://katalog.we-online.com/pbs/datasheet/7443550101.pdf; Part Number: 7443550101; Published Date: December 2018; Publisher: Wurth Elektronik; Size: 1350; Operating Temperature: -40 to +155 degC; Mounting Technology: SMT; Packaging: Tape and Reel; ClassName: DcDc15
R53-R56 = R_Uni: Resistor; ClassName: DcDc15
  R53: Value: 215k
  R54: Value: 56.2k
  R55: Value: 12k1
  R56: Value: 133k
U17 = IC_TPS54560BQDDARQ1: 4.5 V to 60 V Input, 5 A, Step Down DC-DC Converter; ComponentLink1Description: Datasheet; ComponentLink1URL: http://www.ti.com/lit/ds/symlink/tps54560b-q1.pdf; ClassName: DcDc15

## Nets that join several sheets
3V3: MCU (7 pins), CAN0 (C74.2 LED1.2 LED2.2 U15.5), CAN1 (C78.2 LED3.2 LED4.2 U16.5), PSU (18 pins), 3V3 (5 pins)
5V: GD_interface (C56.2 IC2.1 IC2.13 R37.1), CAN0 (C73.2 U15.3), CAN1 (C77.2 U16.3), PSU (C35.1 U11.1), 5V (5 pins)
15V: GD_interface (5 pins), GD_supply (C82.1 L4.2 R53.2)
CAN0_N: main (P5.3 P6.3), CAN0 (R46.2 U15.6)
CAN0_P: main (P5.2 P6.2), CAN0 (R45.1 U15.7)
CAN1_N: main (P5.5 P6.5), CAN1 (R50.2 U16.6)
CAN1_P: main (P5.4 P6.4), CAN1 (R49.1 U16.7)
GND: main (P5.6 P6.6), MCU (25 pins), GD_interface (25 pins), CAN0 (8 pins), CAN1 (8 pins), PSU (31 pins), 3V3 (6 pins), 5V (6 pins), GD_supply (9 pins)
Vin: main (F1.1), PSU (C32.1 U10.1), 3V3 (C86.2 U18.4 U18.5), 5V (C89.2 U19.4 U19.5), GD_supply (C81.2 U17.2)
CAN_R0: MCU (IC3.20), CAN0 (C75.2 Q2.1 U15.4)
CAN_R1: MCU (IC3.51), CAN1 (C79.2 Q4.1 U16.4)
CAN_T0: MCU (IC3.17), CAN0 (Q1.1 U15.1)
CAN_T1: MCU (IC3.65), CAN1 (Q3.1 U16.1)
NetC36_2: MCU (IC3.21), PSU (C36.2 R27.1 U13.1)
NetIC2_3: MCU (IC3.50), GD_interface (IC2.3 R36.8)
NetIC2_5: MCU (IC3.48), GD_interface (IC2.5 R35.8)
NetIC2_7: MCU (IC3.47), GD_interface (IC2.7 R34.5)
NetIC2_9: MCU (IC3.49), GD_interface (IC2.9 R34.6)
NetIC2_11: MCU (IC3.46), GD_interface (IC2.11 R34.7)
NetIC2_14: MCU (IC3.45), GD_interface (IC2.14 R34.8)
NetIC3_52: MCU (IC3.52), GD_interface (P8.15 R37.2)